# EAGLE schematic WheresThePartyAt (EAGLE 5.10)

## Sheet 1 of 4
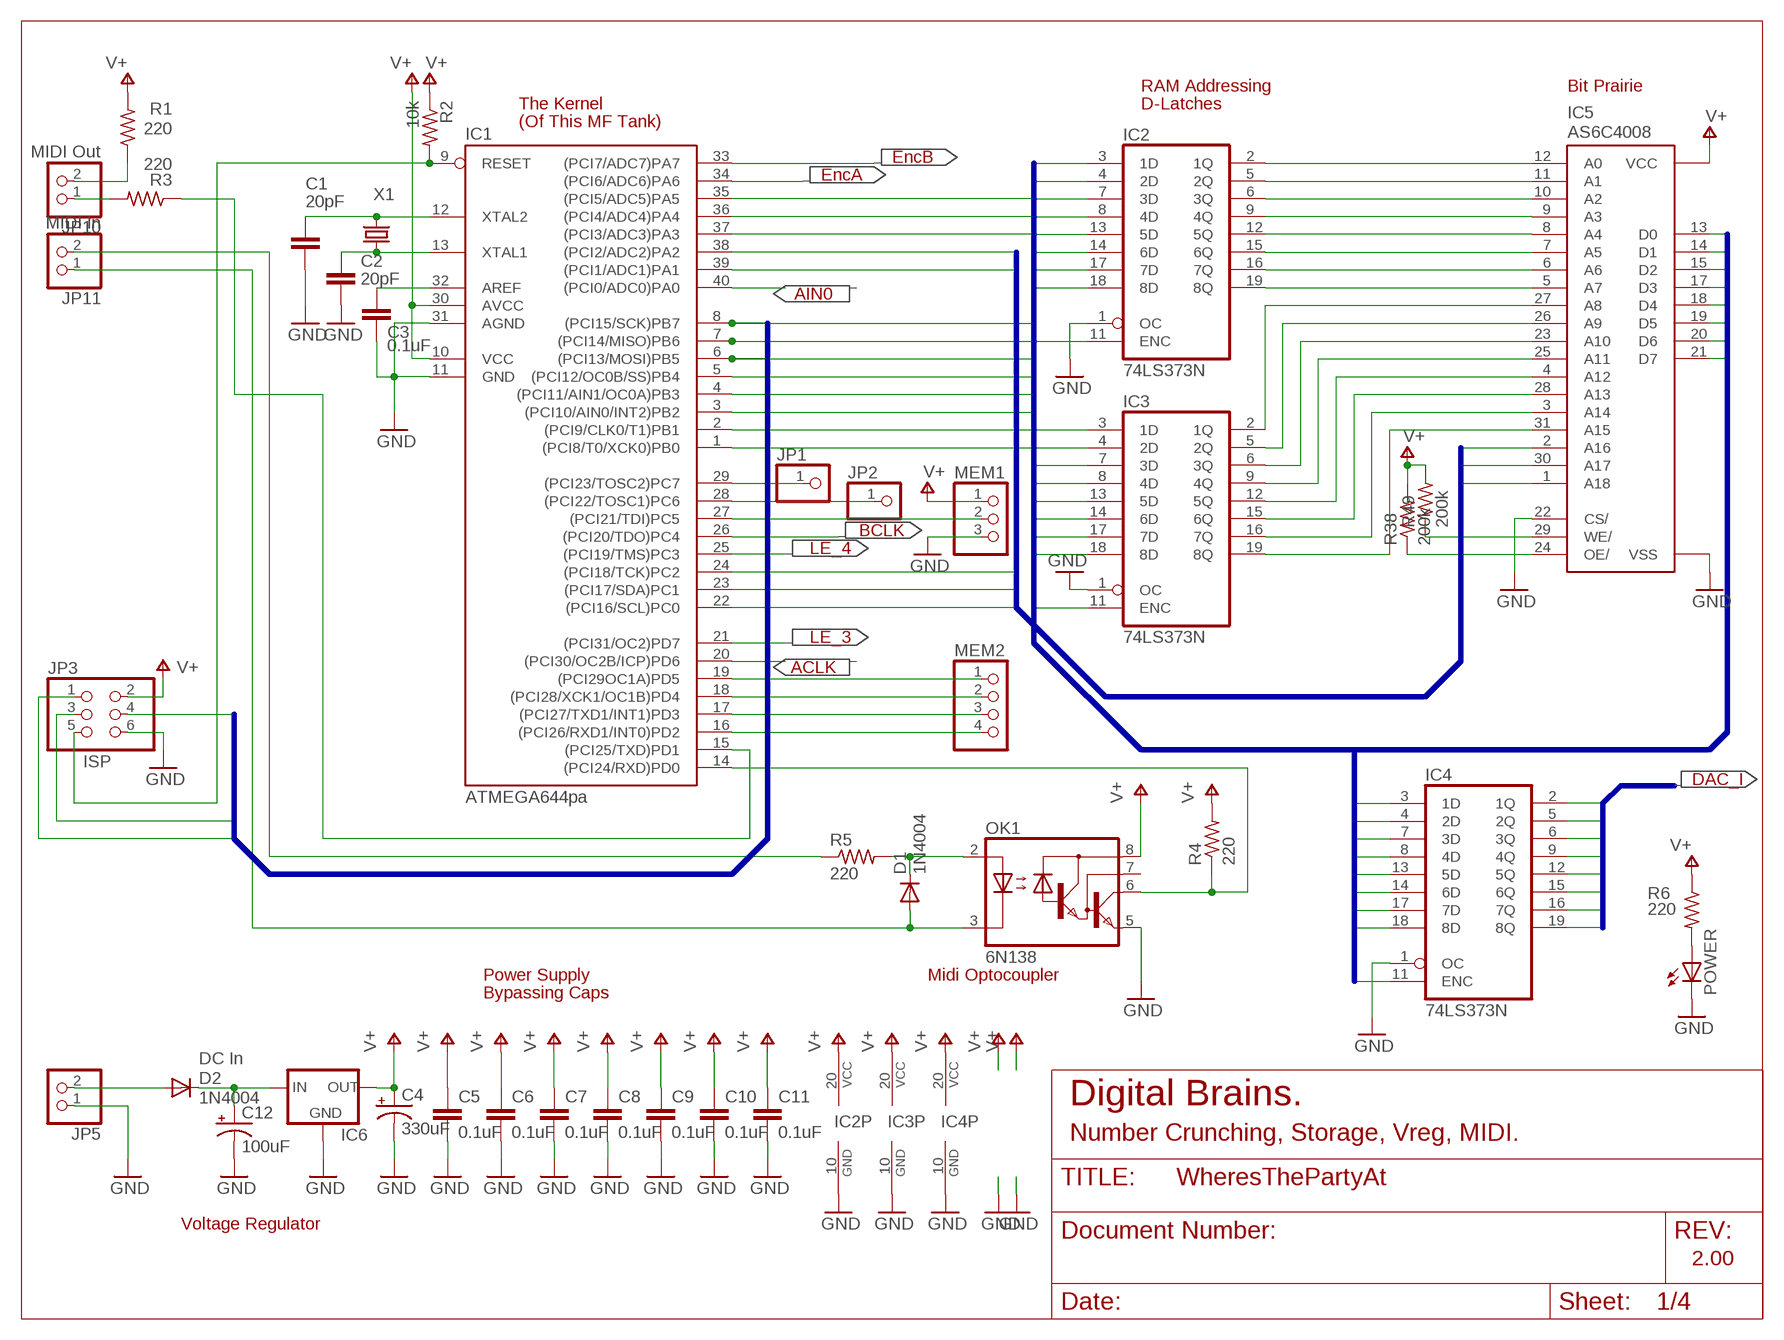
[diagram p0: schematic, sheet 1]

### Parts
C1  20pF  C-EU025-024X044  [C025-024X044]
C2  20pF  C-EU025-024X044  [C025-024X044]
C3  0.1uF  C-EU025-024X044  [C025-024X044]
C4  330uF  CPOL-USE5-8.5  [E5-8,5]
C5  0.1uF  C-EU025-024X044  [C025-024X044]
C6  0.1uF  C-EU025-024X044  [C025-024X044]
C7  0.1uF  C-EU025-024X044  [C025-024X044]
C8  0.1uF  C-EU025-024X044  [C025-024X044]
C9  0.1uF  C-EU025-024X044  [C025-024X044]
C10  0.1uF  C-EU025-024X044  [C025-024X044]
C11  0.1uF  C-EU025-024X044  [C025-024X044]
C12  100uF  CPOL-USE5-8.5  [E5-8,5]
D1  1N4004  [DO41-762]
D2  1N4004  [DO41-762]
IC1  ATMEGA644pa  ATMEGA164-20P  [DIL40]
IC2  74LS373N  [DIL20]
IC3  74LS373N  [DIL20]
IC4  74LS373N  [DIL20]
IC5  AS6C4008  [DIL32]
IC6  78XXL  [78XXL]
JP1  PINHD-1X1  [1X01]
JP2  PINHD-1X1  [1X01]
JP3  ISP  PINHD-2X3  [2X03]
JP5  DC In  PINHD-1X2  [1X02]
JP10  MIDI Out  PINHD-1X2  [1X02]
JP11  MIDI In  PINHD-1X2  [1X02]
MEM1  PINHD-1X3  [1X03]
MEM2  PINHD-1X4  [1X04]
OK1  6N138  [DIL08]
POWER  LED5MM  [LED5MM]
R1  220  R-US_0207/2V  [0207/2V]
R2  10k  R-US_0207/2V  [0207/2V]
R3  220  R-US_0207/2V  [0207/2V]
R4  220  R-US_0207/2V  [0207/2V]
R5  220  R-US_0207/2V  [0207/2V]
R6  220  R-US_0207/2V  [0207/2V]
R38  200k  R-US_0207/2V  [0207/2V]
R49  200k  R-US_0207/2V  [0207/2V]
X1  CRYTALHC49U-V  [HC49U-V]

### Nets
A0: IC2.2(1Q) IC5.12(A0)
A1: IC2.5(2Q) IC5.11(A1)
A2: IC2.6(3Q) IC5.10(A2)
A3: IC2.9(4Q) IC5.9(A3)
A4: IC2.12(5Q) IC5.8(A4)
A5: IC2.15(6Q) IC5.7(A5)
A6: IC2.16(7Q) IC5.6(A6)
A7: IC2.19(8Q) IC5.5(A7)
A8: IC3.2(1Q) IC5.27(A8)
A9: IC3.5(2Q) IC5.26(A9)
A10: IC3.6(3Q) IC5.23(A10)
A11: IC3.9(4Q) IC5.25(A11)
A12: IC3.12(5Q) IC5.4(A12)
A13: IC3.15(6Q) IC5.28(A13)
A14: IC3.16(7Q) IC5.3(A14)
A15: IC3.19(8Q) IC5.31(A15)
A16: IC1.22((PCI16/SCL)PC0) IC5.2(A16)
A17: IC1.23((PCI17/SDA)PC1) IC5.30(A17)
A18: IC1.24((PCI18/TCK)PC2) IC5.1(A18)
ACLK: IC1.20((PCI30/OC2B/ICP)PD6) ; also sheet 4
AIN0: IC1.40((PCI0/ADC0)PA0) ; also sheet 2
BCLK: IC1.26((PCI20/TDO)PC4) ; also sheet 4
DAC0: IC4.2(1Q) ; also sheet 2
DAC1: IC4.5(2Q) ; also sheet 2
DAC2: IC4.6(3Q) ; also sheet 2
DAC3: IC4.9(4Q) ; also sheet 2
DAC4: IC4.12(5Q) ; also sheet 2
DAC5: IC4.15(6Q) ; also sheet 2
DAC6: IC4.16(7Q) ; also sheet 2
DAC7: IC4.19(8Q) ; also sheet 2
ENC_A: IC1.34((PCI6/ADC6)PA6) ; also sheet 3
ENC_B: IC1.33((PCI7/ADC7)PA7) ; also sheet 3
GND: C1.2 C2.2 C3.2 C4.- C5.2 C6.2 C7.2 C8.2 C9.2 C10.2 C11.2 C12.- IC1.11(GND) IC1.31(AGND) IC2.1(OC) IC2.10(GND) IC3.1(OC) IC3.10(GND) IC4.1(OC) IC4.10(GND) IC5.16(VSS) IC5.22(CS/) IC6.GND JP3.6 JP5.1 MEM1.3 OK1.5(GND) POWER.K(C) ; also sheet 2,3,4
LATCH0: IC1.1((PCI8/T0/XCK0)PB0) IC2.3(1D) IC3.3(1D) IC4.3(1D) IC5.13(D0) ; also sheet 3
LATCH1: IC1.2((PCI9/CLK0/T1)PB1) IC2.4(2D) IC3.4(2D) IC4.4(2D) IC5.14(D1) ; also sheet 3
LATCH2: IC1.3((PCI10/AIN0/INT2)PB2) IC2.7(3D) IC3.7(3D) IC4.7(3D) IC5.15(D2) ; also sheet 3
LATCH3: IC1.4((PCI11/AIN1/OC0A)PB3) IC2.8(4D) IC3.8(4D) IC4.8(4D) IC5.17(D3) ; also sheet 3
LATCH4: IC1.5((PCI12/OC0B/SS)PB4) IC2.13(5D) IC3.13(5D) IC4.13(5D) IC5.18(D4) ; also sheet 3
LATCH5/MOSI: IC1.6((PCI13/MOSI)PB5) IC2.14(6D) IC3.14(6D) IC4.14(6D) IC5.19(D5) JP3.4 ; also sheet 3
LATCH6/MISO: IC1.7((PCI14/MISO)PB6) IC2.17(7D) IC3.17(7D) IC4.17(7D) IC5.20(D6) JP3.1 ; also sheet 3
LATCH7/SCK: IC1.8((PCI15/SCK)PB7) IC2.18(8D) IC3.18(8D) IC4.18(8D) IC5.21(D7) JP3.3 ; also sheet 3
LATCH_ENABLE0: IC1.37((PCI3/ADC3)PA3) IC2.11(ENC)
LATCH_ENABLE1: IC1.36((PCI4/ADC4)PA4) IC3.11(ENC)
LATCH_ENABLE2: IC1.35((PCI5/ADC5)PA5) IC4.11(ENC)
LATCH_ENABLE3: IC1.21((PCI31/OC2)PD7) ; also sheet 3
LATCH_ENABLE4: IC1.25((PCI19/TMS)PC3) ; also sheet 3
MEM_CD: IC1.27((PCI21/TDI)PC5) MEM1.2
MEM_CS: IC1.19((PCI29OC1A)PD5) MEM2.1
MEM_SCK: IC1.18((PCI28/XCK1/OC1B)PD4) MEM2.2
MEM_SI: IC1.17((PCI27/TXD1/INT1)PD3) MEM2.3
MEM_SO: IC1.16((PCI26/RXD1/INT0)PD2) MEM2.4
N$1: C1.1 IC1.12(XTAL2) X1.2
N$2: C2.1 IC1.13(XTAL1) X1.1
N$3: C12.+ D2.C IC6.IN
N$5: IC1.29((PCI23/TOSC2)PC7) JP1.1
N$8: JP11.2 R5.1
N$9: D1.A JP11.1 OK1.3(C)
N$10: D1.C OK1.2(A) R5.2
N$12: JP10.1 R3.2
N$13: JP10.2 R1.1
N$15: D2.A JP5.2
N$25: IC1.28((PCI22/TOSC1)PC6) JP2.1
N$47: POWER.A R6.2
N$87: C3.1 IC1.32(AREF)
OE: IC1.38((PCI2/ADC2)PA2) IC5.24(OE/) R38.1
RESET: IC1.9(RESET) JP3.5 R2.2
RX0: IC1.14((PCI24/RXD)PD0) OK1.6(VO) R4.1
TX0: IC1.15((PCI25/TXD)PD1) R3.1
V+: C4.+ C5.1 C6.1 C7.1 C8.1 C9.1 C10.1 C11.1 IC1.10(VCC) IC1.30(AVCC) IC2.20(VCC) IC3.20(VCC) IC4.20(VCC) IC5.32(VCC) IC6.OUT JP3.2 MEM1.1 OK1.8(VCC) R1.2 R2.1 R4.2 R6.1 R38.2 R49.2 ; also sheet 2,3,4
WE: IC1.39((PCI1/ADC1)PA1) IC5.29(WE/) R49.1
Unconnected: OK1.7(VB)

### Buses
SCK,MISO,MOSI
DAC[0..7]
A[16..18],OE,WE
LATCH[0..4],LATCH5/MOSI,LATCH6/MISO,LATCH7/SCK,LATCH_ENABLE[0..4]

### Notes on the sheet
- RAM Addressing | Bit Prairie
- The Kernel | D-Latches
- (Of This MF Tank)
- EncB
- EncA
- AIN0
- BCLK
- LE_4
- LE_3
- ACLK
- DAC_I
- Power Supply | Midi Optocoupler
- Bypassing Caps
- Digital Brains.
- Number Crunching, Storage, Vreg, MIDI.
- Voltage Regulator
- 2.00

## Sheet 2 of 4
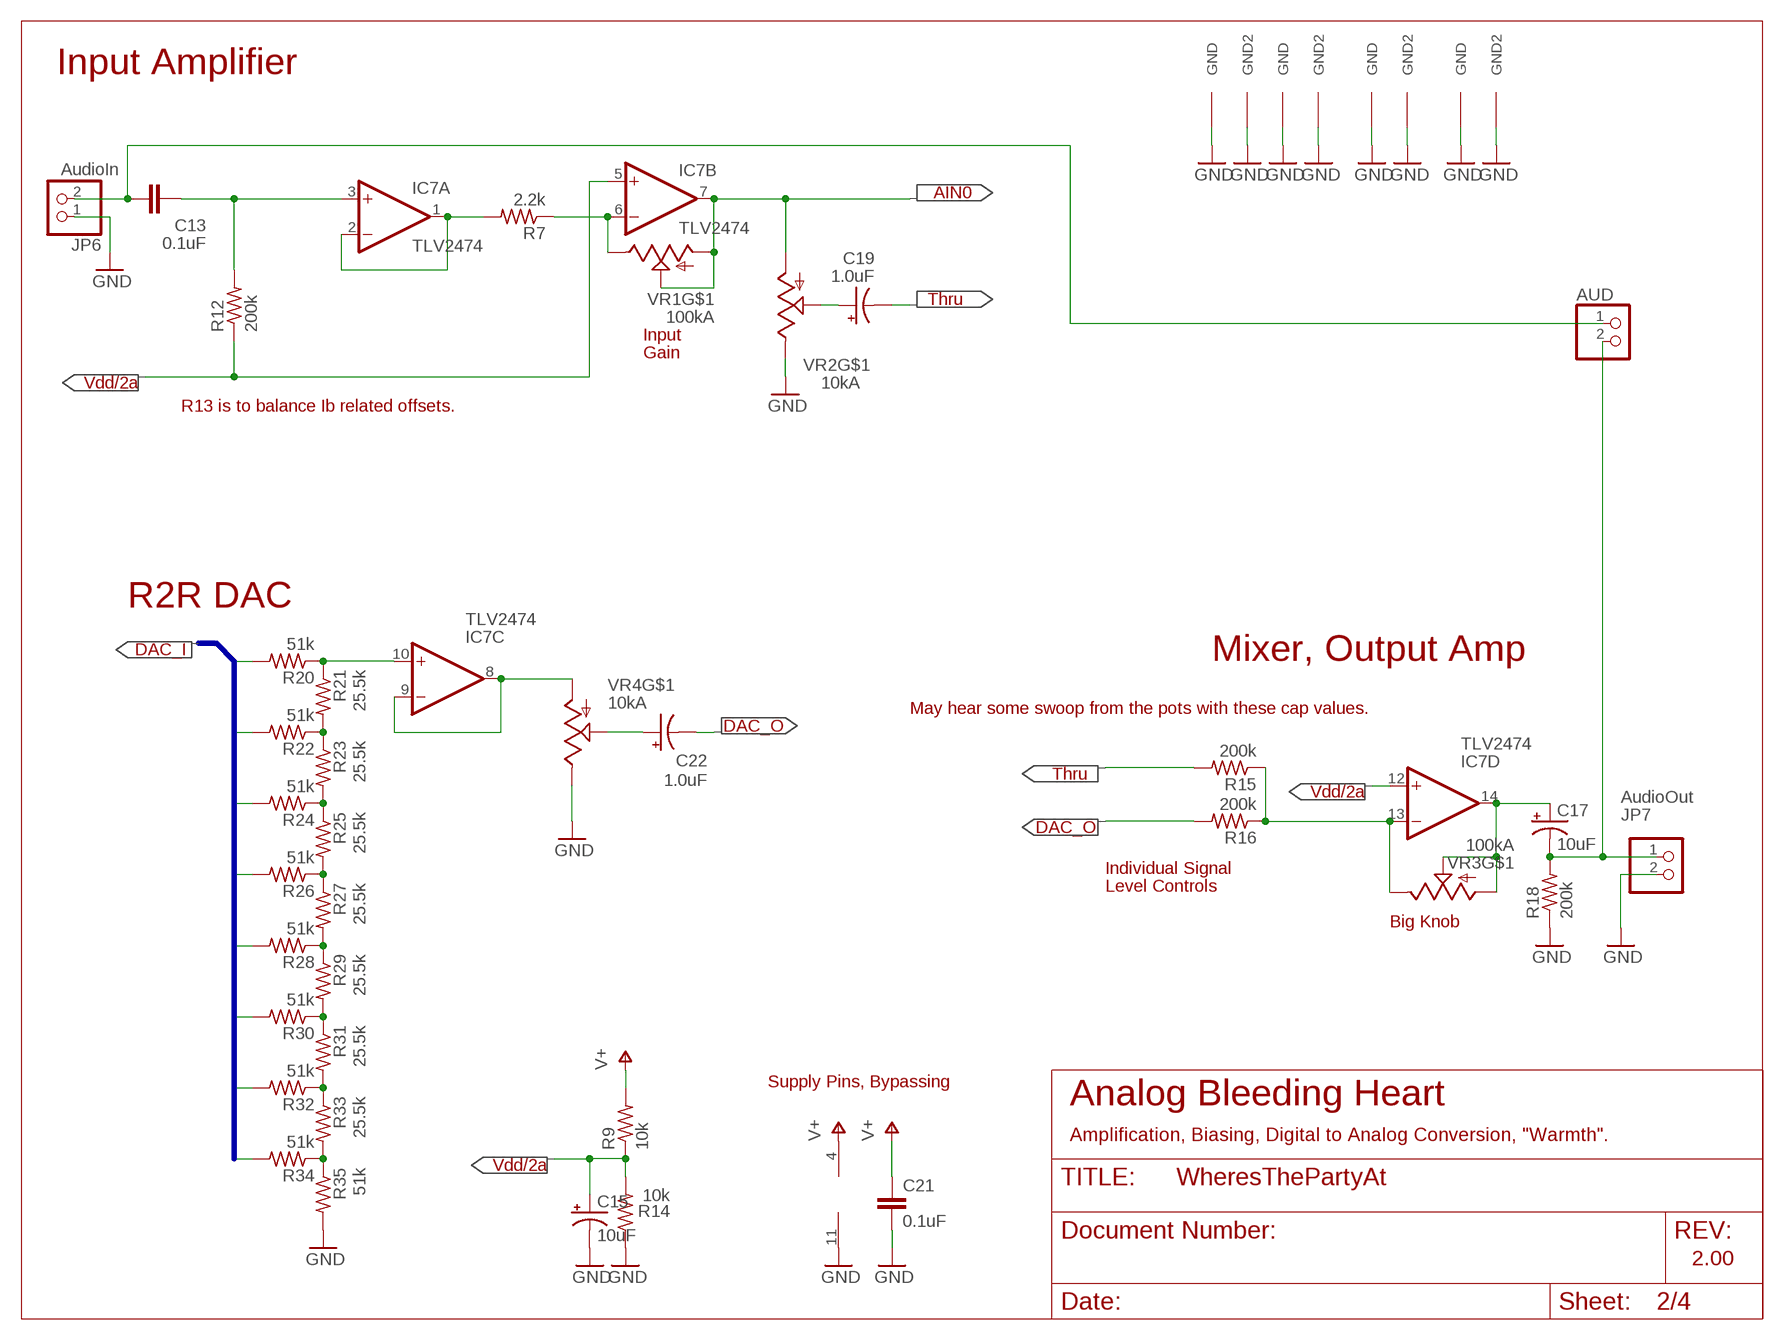
[diagram p1: schematic, sheet 2]

### Parts
AUD  PINHD-1X2  [1X02]
C13  0.1uF  C-EU025-024X044  [C025-024X044]
C15  10uF  CPOL-USE2.5-6  [E2,5-6]
C17  10uF  CPOL-USE2.5-6  [E2,5-6]
C19  1.0uF  CPOL-USE2-5  [E2-5]
C21  0.1uF  C-EU025-024X044  [C025-024X044]
C22  1.0uF  CPOL-USE2-5  [E2-5]
IC7  TLV2474  LM324N  [DIL14]
JP6  AudioIn  PINHD-1X2  [1X02]
JP7  AudioOut  PINHD-1X2  [1X02]
R7  2.2k  R-US_0207/2V  [0207/2V]
R9  10k  R-US_0207/2V  [0207/2V]
R12  200k  R-US_0207/2V  [0207/2V]
R14  10k  R-US_0207/2V  [0207/2V]
R15  200k  R-US_0207/2V  [0207/2V]
R16  200k  R-US_0207/2V  [0207/2V]
R18  200k  R-US_0207/2V  [0207/2V]
R20  51k  R-US_0207/2V  [0207/2V]
R21  25.5k  R-US_0207/2V  [0207/2V]
R22  51k  R-US_0207/2V  [0207/2V]
R23  25.5k  R-US_0207/2V  [0207/2V]
R24  51k  R-US_0207/2V  [0207/2V]
R25  25.5k  R-US_0207/2V  [0207/2V]
R26  51k  R-US_0207/2V  [0207/2V]
R27  25.5k  R-US_0207/2V  [0207/2V]
R28  51k  R-US_0207/2V  [0207/2V]
R29  25.5k  R-US_0207/2V  [0207/2V]
R30  51k  R-US_0207/2V  [0207/2V]
R31  25.5k  R-US_0207/2V  [0207/2V]
R32  51k  R-US_0207/2V  [0207/2V]
R33  25.5k  R-US_0207/2V  [0207/2V]
R34  51k  R-US_0207/2V  [0207/2V]
R35  51k  R-US_0207/2V  [0207/2V]
VR1  100kA  POTALPHA  [ALPHA_9MM_POT]
VR2  10kA  POTALPHA  [ALPHA_9MM_POT]
VR3  100kA  POTALPHA  [ALPHA_9MM_POT]
VR4  10kA  POTALPHA  [ALPHA_9MM_POT]

### Nets
AIN0: IC7.7(B:OUT) VR1.P$2(S) VR1.P$3(A) VR2.P$3(A) ; also sheet 1
AUDIO_IN: AUD.1 C13.1 JP6.2
AUDIO_OUT: AUD.2 C17.- JP7.1 R18.2
DAC: IC7.8(C:OUT) IC7.9(C:-IN) VR4.P$3(A)
DAC0: R34.2 ; also sheet 1
DAC1: R32.2 ; also sheet 1
DAC2: R30.2 ; also sheet 1
DAC3: R28.2 ; also sheet 1
DAC4: R26.2 ; also sheet 1
DAC5: R24.2 ; also sheet 1
DAC6: R22.2 ; also sheet 1
DAC7: R20.2 ; also sheet 1
DAC_O: C22.- R16.2
GND: C15.- C21.2 IC7.11(P:V-) JP6.1 JP7.2 R14.1 R18.1 R35.2 VR1.P$4(GND) VR1.P$5(GND2) VR2.P$1(E) VR2.P$4(GND) VR2.P$5(GND2) VR3.P$4(GND) VR3.P$5(GND2) VR4.P$1(E) VR4.P$4(GND) VR4.P$5(GND2) ; also sheet 1,3,4
N$7: IC7.1(A:OUT) IC7.2(A:-IN) R7.2
N$27: C19.+ VR2.P$2(S)
N$34: C22.+ VR4.P$2(S)
N$36: R21.2 R22.1 R23.1
N$39: R23.2 R24.1 R25.1
N$40: R25.2 R26.1 R27.1
N$41: R27.2 R28.1 R29.1
N$42: R29.2 R30.1 R31.1
N$43: R31.2 R32.1 R33.1
N$44: R33.2 R34.1 R35.1
N$45: IC7.10(C:+IN) R20.1 R21.1
N$46: C17.+ IC7.14(D:OUT) VR3.P$2(S) VR3.P$3(A)
N$50: C13.2 IC7.3(A:+IN) R12.2
N$55: IC7.6(B:-IN) R7.1 VR1.P$1(E)
N$60: IC7.13(D:-IN) R15.1 R16.1 VR3.P$1(E)
THRU: C19.- R15.2
V+: C21.1 IC7.4(P:V+) R9.2 ; also sheet 1,3,4
VDD/2A: C15.+ IC7.5(B:+IN) IC7.12(D:+IN) R9.1 R12.1 R14.2

### Buses
DAC[0..7]

### Notes on the sheet
- Input Amplifier
- AIN0
- Thru
- Input
- Gain
- Vdd/2a
- R13 is to balance Ib related offsets.
- R2R DAC
- DAC_I
- Mixer, Output Amp
- May hear some swoop from the pots with these cap values.
- DAC_O
- Thru
- Vdd/2a
- DAC_O
- Individual Signal
- Level Controls
- Big Knob
- Supply Pins, Bypassing
- Analog Bleeding Heart
- Amplification, Biasing, Digital to Analog Conversion, "Warmth".
- Vdd/2a
- 2.00

## Sheet 3 of 4
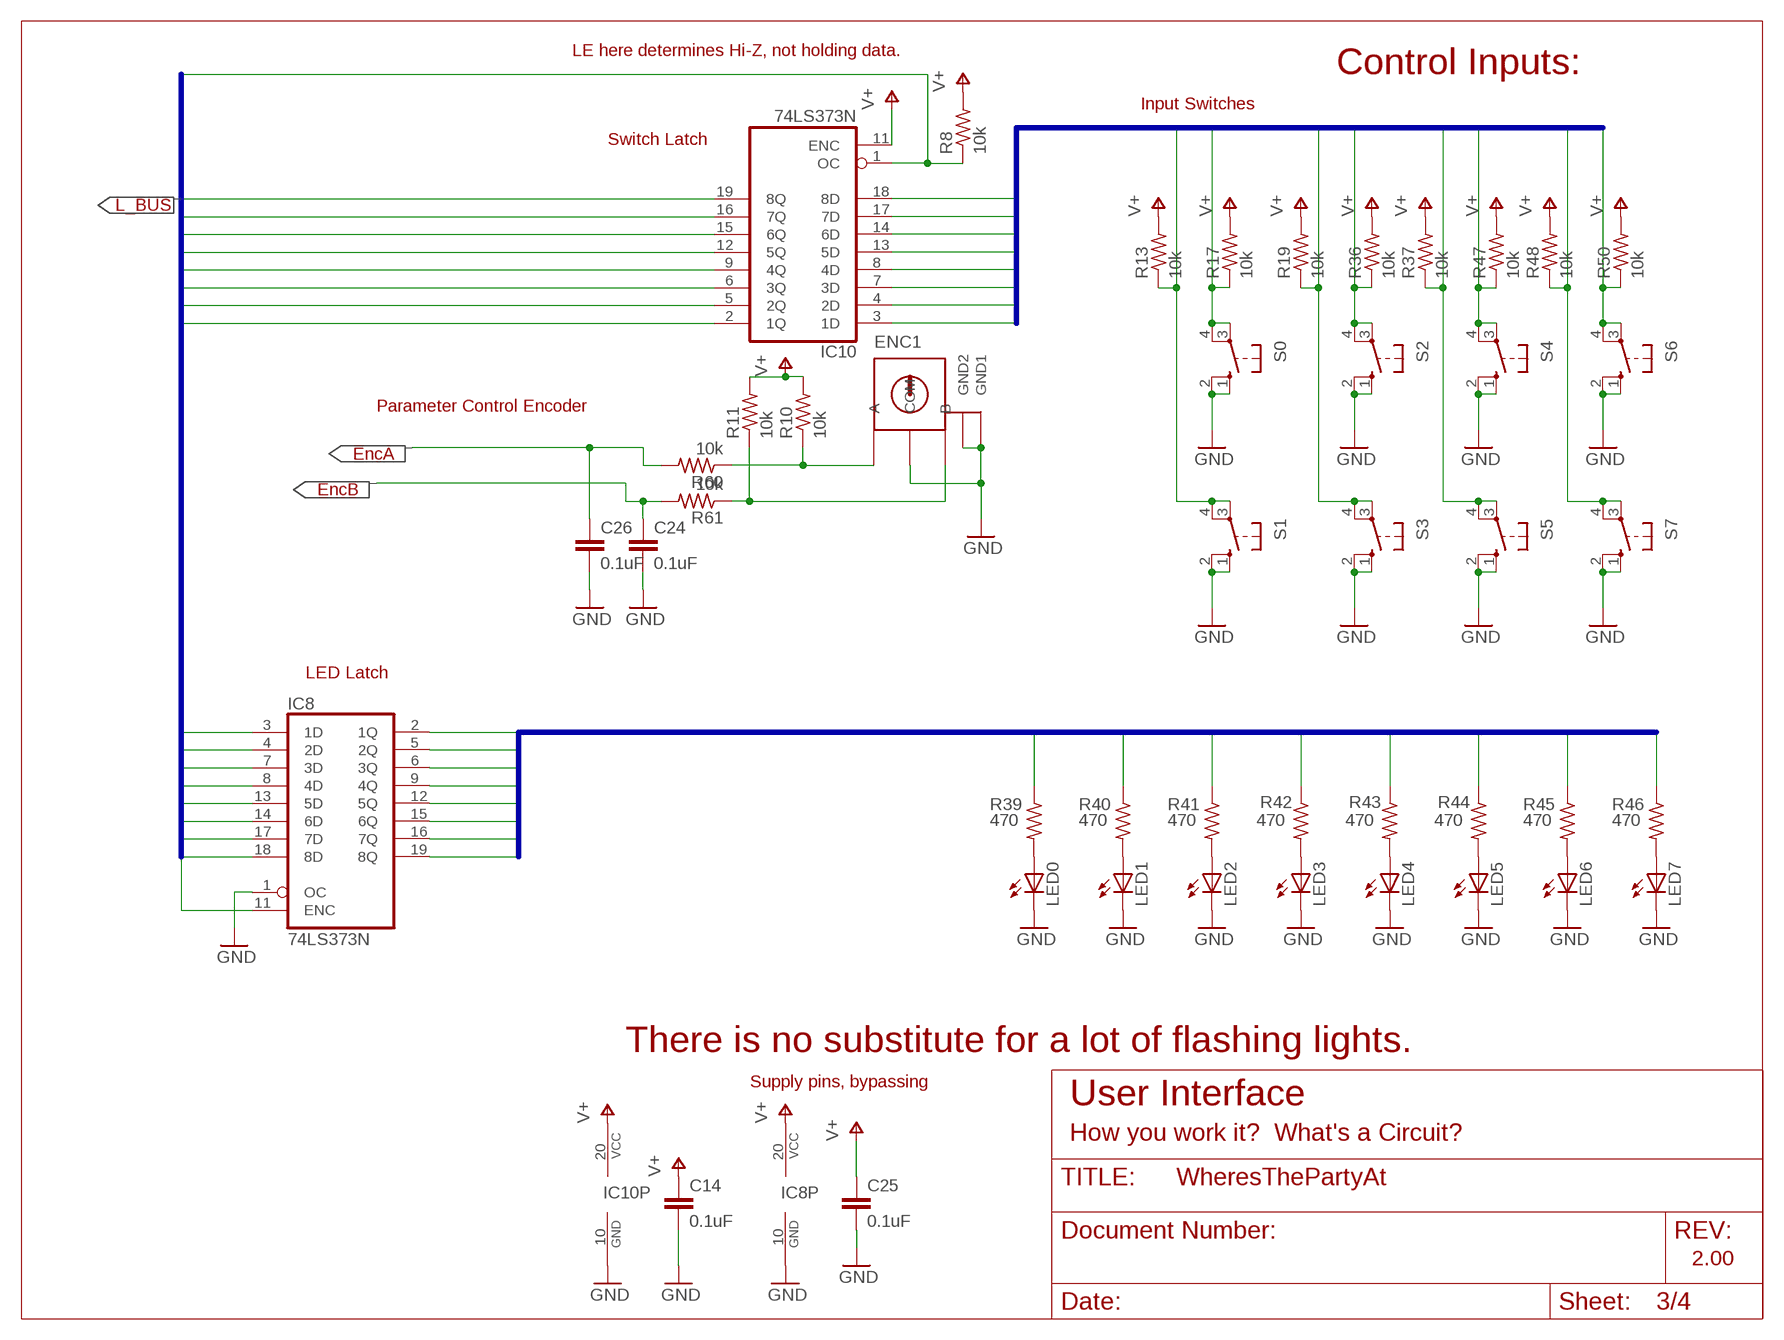
[diagram p2: schematic, sheet 3]

### Parts
C14  0.1uF  C-EU025-024X044  [C025-024X044]
C24  0.1uF  C-EU025-024X044  [C025-024X044]
C25  0.1uF  C-EU025-024X044  [C025-024X044]
C26  0.1uF  C-EU025-024X044  [C025-024X044]
ENC1  RE111F_ROTARY_ENCODER  [RE111F_40_ENC]
IC8  74LS373N  [DIL20]
IC10  74LS373N  [DIL20]
LED0  LED5MM  [LED5MM]
LED1  LED5MM  [LED5MM]
LED2  LED5MM  [LED5MM]
LED3  LED5MM  [LED5MM]
LED4  LED5MM  [LED5MM]
LED5  LED5MM  [LED5MM]
LED6  LED5MM  [LED5MM]
LED7  LED5MM  [LED5MM]
R8  10k  R-US_0207/2V  [0207/2V]
R10  10k  R-US_0207/2V  [0207/2V]
R11  10k  R-US_0207/2V  [0207/2V]
R13  10k  R-US_0207/2V  [0207/2V]
R17  10k  R-US_0207/2V  [0207/2V]
R19  10k  R-US_0207/2V  [0207/2V]
R36  10k  R-US_0207/2V  [0207/2V]
R37  10k  R-US_0207/2V  [0207/2V]
R39  470  R-US_0207/2V  [0207/2V]
R40  470  R-US_0207/2V  [0207/2V]
R41  470  R-US_0207/2V  [0207/2V]
R42  470  R-US_0207/2V  [0207/2V]
R43  470  R-US_0207/2V  [0207/2V]
R44  470  R-US_0207/2V  [0207/2V]
R45  470  R-US_0207/2V  [0207/2V]
R46  470  R-US_0207/2V  [0207/2V]
R47  10k  R-US_0207/2V  [0207/2V]
R48  10k  R-US_0207/2V  [0207/2V]
R50  10k  R-US_0207/2V  [0207/2V]
R60  10k  R-US_0207/2V  [0207/2V]
R61  10k  R-US_0207/2V  [0207/2V]
S0  10-XX  [B3F-10XX]
S1  10-XX  [B3F-10XX]
S2  10-XX  [B3F-10XX]
S3  10-XX  [B3F-10XX]
S4  10-XX  [B3F-10XX]
S5  10-XX  [B3F-10XX]
S6  10-XX  [B3F-10XX]
S7  10-XX  [B3F-10XX]

### Nets
ENC_A: C26.1 R60.2 ; also sheet 1
ENC_B: C24.1 R61.2 ; also sheet 1
GND: C14.2 C24.2 C25.2 C26.2 ENC1.COM ENC1.MNT1(GND1) ENC1.MNT2(GND2) IC8.1(OC) IC8.10(GND) IC10.10(GND) LED0.K(C) LED1.K(C) LED2.K(C) LED3.K(C) LED4.K(C) LED5.K(C) LED6.K(C) LED7.K(C) S0.1(S) S0.2(S1) S1.1(S) S1.2(S1) S2.1(S) S2.2(S1) S3.1(S) S3.2(S1) S4.1(S) S4.2(S1) S5.1(S) S5.2(S1) S6.1(S) S6.2(S1) S7.1(S) S7.2(S1) ; also sheet 1,2,4
LATCH0: IC8.3(1D) IC10.2(1Q) ; also sheet 1
LATCH1: IC8.4(2D) IC10.5(2Q) ; also sheet 1
LATCH2: IC8.7(3D) IC10.6(3Q) ; also sheet 1
LATCH3: IC8.8(4D) IC10.9(4Q) ; also sheet 1
LATCH4: IC8.13(5D) IC10.12(5Q) ; also sheet 1
LATCH5/MOSI: IC8.14(6D) IC10.15(6Q) ; also sheet 1
LATCH6/MISO: IC8.17(7D) IC10.16(7Q) ; also sheet 1
LATCH7/SCK: IC8.18(8D) IC10.19(8Q) ; also sheet 1
LATCH_ENABLE3: IC8.11(ENC) ; also sheet 1
LATCH_ENABLE4: IC10.1(OC) R8.1 ; also sheet 1
LED0: IC8.2(1Q) R39.1
LED1: IC8.5(2Q) R40.1
LED2: IC8.6(3Q) R41.1
LED3: IC8.9(4Q) R42.1
LED4: IC8.12(5Q) R43.1
LED5: IC8.15(6Q) R44.1
LED6: IC8.16(7Q) R45.1
LED7: IC8.19(8Q) R46.1
N$35: ENC1.B R11.1 R61.1
N$37: ENC1.A R10.1 R60.1
N$68: LED0.A R39.2
N$70: LED1.A R40.2
N$71: LED2.A R41.2
N$72: LED3.A R42.2
N$73: LED4.A R43.2
N$74: LED5.A R44.2
N$75: LED6.A R45.2
N$76: LED7.A R46.2
SW0: IC10.3(1D) R17.1 S0.3(P) S0.4(P1)
SW1: IC10.4(2D) R13.1 S1.3(P) S1.4(P1)
SW2: IC10.7(3D) R36.1 S2.3(P) S2.4(P1)
SW3: IC10.8(4D) R19.1 S3.3(P) S3.4(P1)
SW4: IC10.13(5D) R47.1 S4.3(P) S4.4(P1)
SW5: IC10.14(6D) R37.1 S5.3(P) S5.4(P1)
SW6: IC10.17(7D) R50.1 S6.3(P) S6.4(P1)
SW7: IC10.18(8D) R48.1 S7.3(P) S7.4(P1)
V+: C14.1 C25.1 IC8.20(VCC) IC10.11(ENC) IC10.20(VCC) R8.2 R10.2 R11.2 R13.2 R17.2 R19.2 R36.2 R37.2 R47.2 R48.2 R50.2 ; also sheet 1,2,4

### Buses
SW[0..7]
LED[0..7]
LATCH[0..4],LATCH5/MOSI,LATCH6/MISO,LATCH7/SCK,LATCH_ENABLE[0..4]

### Notes on the sheet
- LE here determines Hi-Z, not holding data.
- Control Inputs:
- Input Switches
- Switch Latch
- L_BUS
- Parameter Control Encoder
- EncA
- EncB
- LED Latch
- There is no substitute for a lot of flashing lights.
- Supply pins, bypassing
- User Interface
- How you work it?  What's a Circuit?
- 2.00

## Sheet 4 of 4
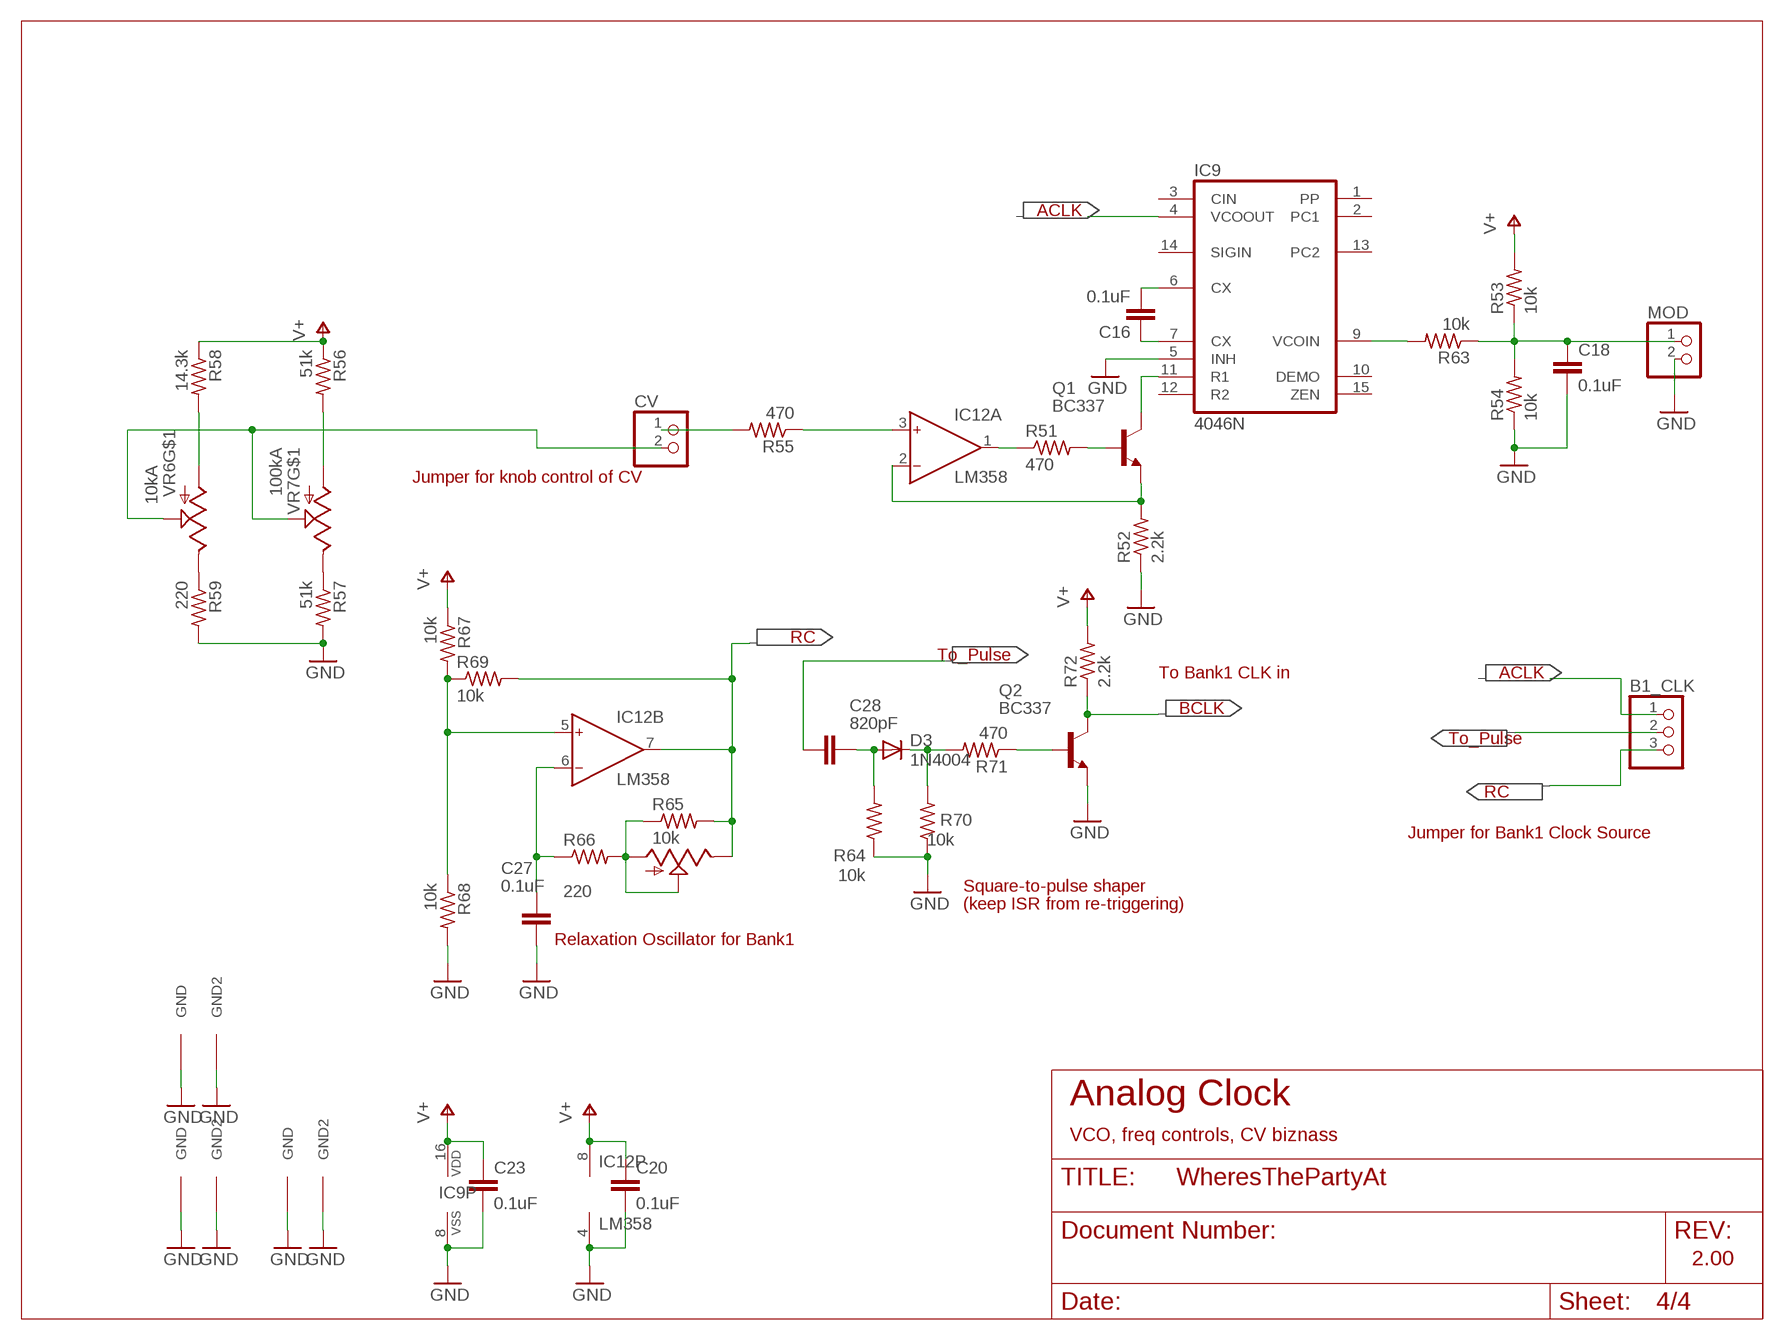
[diagram p3: schematic, sheet 4]

### Parts
B1_CLK  PINHD-1X3  [1X03]
C16  0.1uF  C-EU025-024X044  [C025-024X044]
C18  0.1uF  C-EU025-024X044  [C025-024X044]
C20  0.1uF  C-EU025-024X044  [C025-024X044]
C23  0.1uF  C-EU025-024X044  [C025-024X044]
C27  0.1uF  C-EU025-024X044  [C025-024X044]
C28  820pF  C-EU025-024X044  [C025-024X044]
CV  PINHD-1X2  [1X02]
D3  1N4004  [DO41-762]
IC9  4046N  [DIL16]
IC12  LM358  AD712N  [DIL08]
MOD  PINHD-1X2  [1X02]
Q1  BC337  [TO92]
Q2  BC337  [TO92]
R51  470  R-US_0207/2V  [0207/2V]
R52  2.2k  R-US_0207/2V  [0207/2V]
R53  10k  R-US_0207/2V  [0207/2V]
R54  10k  R-US_0207/2V  [0207/2V]
R55  470  R-US_0207/2V  [0207/2V]
R56  51k  R-US_0207/2V  [0207/2V]
R57  51k  R-US_0207/2V  [0207/2V]
R58  14.3k  R-US_0207/2V  [0207/2V]
R59  220  R-US_0207/2V  [0207/2V]
R63  10k  R-US_0207/2V  [0207/2V]
R64  10k  R-US_0207/2V  [0207/2V]
R65  10k  R-US_0207/2V  [0207/2V]
R66  220  R-US_0207/2V  [0207/2V]
R67  10k  R-US_0207/2V  [0207/2V]
R68  10k  R-US_0207/2V  [0207/2V]
R69  10k  R-US_0207/2V  [0207/2V]
R70  10k  R-US_0207/2V  [0207/2V]
R71  470  R-US_0207/2V  [0207/2V]
R72  2.2k  R-US_0207/2V  [0207/2V]
VR5  10kA  POTALPHA  [ALPHA_9MM_POT]
VR6  10kA  POTALPHA  [ALPHA_9MM_POT]
VR7  100kA  POTALPHA  [ALPHA_9MM_POT]

### Nets
ACLK: B1_CLK.1 IC9.4(VCOOUT) ; also sheet 1
BCLK: Q2.3(C) R72.1 ; also sheet 1
CV_IN: IC12.3(A:IN+) R55.1
CV_KNOB: CV.2 VR6.P$2(S) VR7.P$2(S)
GND: C18.2 C20.2 C23.2 C27.1 IC9.5(INH) IC9.8(VSS) IC12.4(P:V-) MOD.2 Q2.1(E) R52.1 R54.1 R57.2 R59.2 R64.1 R68.2 R70.1 VR5.P$4(GND) VR5.P$5(GND2) VR6.P$4(GND) VR6.P$5(GND2) VR7.P$4(GND) VR7.P$5(GND2) ; also sheet 1,2,3
N$4: IC9.11(R1) Q1.3(C)
N$6: R56.2 VR7.P$3(A)
N$11: C16.2 IC9.6(CX)
N$14: R57.1 VR7.P$1(E)
N$16: C16.1 IC9.7(CX)
N$17: Q1.2(B) R51.2
N$18: C28.1 D3.A R64.2
N$19: R58.2 VR6.P$3(A)
N$20: R59.1 VR6.P$1(E)
N$21: D3.C R70.2 R71.2
N$22: IC12.2(A:IN-) Q1.1(E) R52.2
N$23: Q2.2(B) R71.1
N$24: IC12.1(A:OUT) R51.1
N$26: C18.1 MOD.1 R53.1 R54.2 R63.1
N$28: CV.1 R55.2
N$29: IC9.9(VCOIN) R63.2
N$38: C27.2 IC12.6(B:IN-) R66.1
N$48: IC12.5(B:IN+) R67.2 R68.1 R69.1
N$51: R65.1 R66.2 VR5.P$2(S) VR5.P$3(A)
RC: B1_CLK.3 IC12.7(B:OUT) R65.2 R69.2 VR5.P$1(E)
TO_PULSE: B1_CLK.2 C28.2
V+: C20.1 C23.1 IC9.16(VDD) IC12.8(P:V+) R53.2 R56.1 R58.1 R67.1 R72.2 ; also sheet 1,2,3
Unconnected: IC9.1(PP) IC9.2(PC1) IC9.3(CIN) IC9.10(DEMO) IC9.12(R2) IC9.13(PC2) IC9.14(SIGIN) IC9.15(ZEN)

### Notes on the sheet
- ACLK
- Jumper for knob control of CV
- RC
- To_Pulse
- ACLK
- To Bank1 CLK in
- BCLK
- To_Pulse
- RC
- Jumper for Bank1 Clock Source
- Square-to-pulse shaper
- (keep ISR from re-triggering)
- Relaxation Oscillator for Bank1
- Analog Clock
- VCO, freq controls, CV biznass
- 2.00

## Library data of the parts
AUD CV JP5-JP7 JP10 JP11 MOD = pinhead:PINHD-1X2: PIN HEADER
B1_CLK MEM1 = pinhead:PINHD-1X3: PIN HEADER
C1-C3 C5-C11 C13 C14 C16 C18 C20 C21 C23-C28 = rcl:C-EU: CAPACITOR, European symbol
C4 C12 C15 C17 C19 C22 = rcl:CPOL-US: POLARIZED CAPACITOR, American symbol
D1-D3 = TBParts:1N4004: DIODE general purpose rectifier, 1 A This one has been edited to be on an 0.3" (7.62mm) grid. TB
ENC1 = TBParts:RE111F_ROTARY_ENCODER: Taiwan Alpha Vertical Mount 11mm encoders. This one is 20ppr and requires a noise filter to work right. There are a million options on these things.
IC1 = avr_big:ATMEGA164*P: MICROCONTROLLER 16 Kbytes FLASH 1 Kbytes SRAM 512 Bytes EEPROM DUAL USART 8-channel 10 bit ADC
IC2-IC4 IC8 IC10 = 74xx-us:74*373: Octal D type transparent LATCH, edge triggered
IC5 = TBParts:AS6C4008: Alliance Semiconductor 55nS SRAM, 512k. Available in PDIP, SOIC, and TSOP I think. Fairly low power, not lightning fast, 2.7-5v I think. Cheap.
IC6 = v-reg:78XXL: VOLTAGE REGULATOR
IC7 = linear:LM324: OP AMP
IC9 = 40xx:4046: Micropower PLL
IC12 = analog-devices:AD712: Dual Precision, Low Cost, High Speed BiFET Op Amp Source: http://www.analog.com/static/imported-files/data_sheets/AD712.pdf
JP1 JP2 = pinhead:PINHD-1X1: PIN HEADER
JP3 = pinhead:PINHD-2X3: PIN HEADER
LED0 LED1-LED7 POWER = SparkFunEagle-6-6-07:LED: LEDs Standard schematic elements and footprints for 5mm, 3mm, 1206, and 0603 sized LEDs. 5mm - Spark Fun Electronics SKU : COM-00529 (and others)
MEM2 = pinhead:PINHD-1X4: PIN HEADER
OK1 = optocoupler:6N138: MOTOROLA OPTO COUPLER
Q1 Q2 = transistor-npn:BC337*: NPN Transistor
R1-R61 R63-R72 = rcl:R-US_: RESISTOR, American symbol
S0 S1-S7 = switch-omron:10-XX: OMRON SWITCH
VR1-VR7 = TBParts:POT
X1 = crystal:CRYTAL: CRYSTAL